# EAGLE design Adafruit AirLift FeatherWing (EAGLE 9.3.2)
COMPANY: ADAFRUIT INDUSTRIES; DRAWN: KTOWN; REV: B
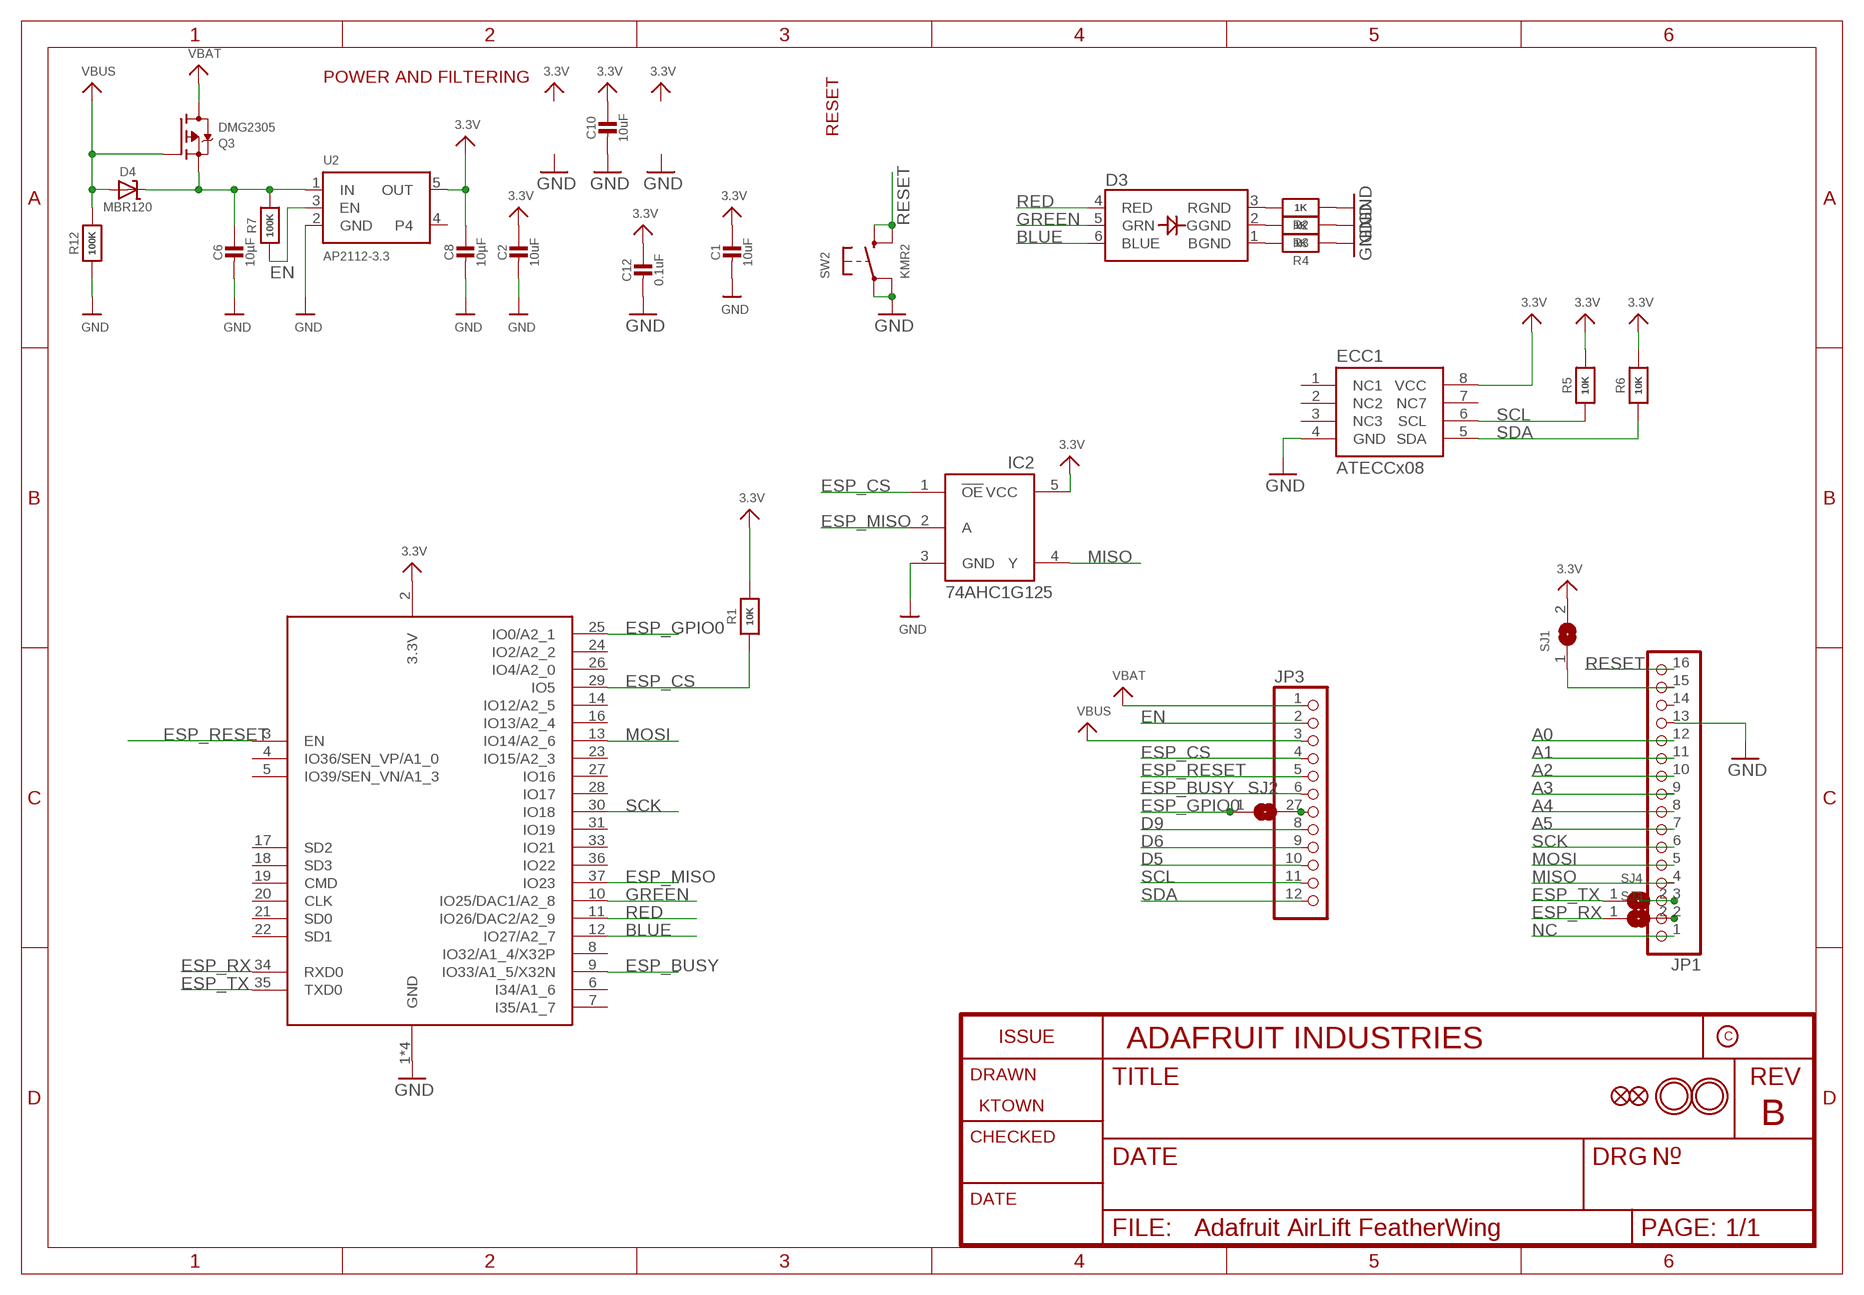
[diagram p0: schematic, sheet 1]

## Parts
C1  10uF  CAP_CERAMIC0805-NOOUTLINE  [0805-NO]
C2  10uF  CAP_CERAMIC0805-NOOUTLINE  [0805-NO]
C6  10µF  CAP_CERAMIC0805-NOOUTLINE  [0805-NO]
C8  10µF  CAP_CERAMIC0805-NOOUTLINE  [0805-NO]
C10  10uF  CAP_CERAMIC0805-NOOUTLINE  [0805-NO]
C12  0.1uF  CAP_CERAMIC0603_NO  [0603-NO]
D3  LED_RGB_PLCC6CREE-CLV6A  [RGBLED_PLCC6]
D4  MBR120  DIODE-SCHOTTKYSOD-123  [SOD-123]
ECC1  ATECCx08  ATECC108  [SOIC8]
IC2  74AHC1G125  [SOT23-5L]
JP1  HEADER-1X16_MIN  [1X16_ROUND_MIN]
JP3  HEADER-1X12_MIN  [1X12_ROUND_MIN]
Q3  DMG2305  MOSFET-P  [SOT23-R]
R1  10K  RESISTOR_0603_NOOUT  [0603-NO]
R2  1K  RESISTOR_0603_NOOUT  [0603-NO]
R3  1K  RESISTOR_0603_NOOUT  [0603-NO]
R4  1K  RESISTOR_0603_NOOUT  [0603-NO]
R5  10K  RESISTOR_0603_NOOUT  [0603-NO]
R6  10K  RESISTOR_0603_NOOUT  [0603-NO]
R7  100K  RESISTOR_0603_NOOUT  [0603-NO]
R12  100K  RESISTOR_0603_NOOUT  [0603-NO]
SJ1  SOLDERJUMPER  [SOLDERJUMPER_ARROW_NOPASTE]
SJ2  SOLDERJUMPER  [SOLDERJUMPER_ARROW_NOPASTE]
SJ3  SOLDERJUMPER  [SOLDERJUMPER_ARROW_NOPASTE]
SJ4  SOLDERJUMPER  [SOLDERJUMPER_ARROW_NOPASTE]
SW2  KMR2  SWITCH_TACT_SMT4.6X2.8  [BTN_KMR2_4.6X2.8]
U2  AP2112-3.3  VREG_SOT23-5  [SOT23-5]
U$31  MOUNTINGHOLE2.5  [MOUNTINGHOLE_2.5_PLATED]
U$32  MOUNTINGHOLE2.5  [MOUNTINGHOLE_2.5_PLATED]
U$34  FIDUCIAL_1MM  [FIDUCIAL_1MM]
U$35  FIDUCIAL_1MM  [FIDUCIAL_1MM]
X3  ESP32_WROOM32_SKINNY  [WROOM32_SKINNY]

## Nets
3.3V: C1.1 C2.1 C8.1 C10.1 C12.1 ECC1.8(VCC) IC2.5(VCC) R1.2 R5.2 R6.2 SJ1.2 U2.5(OUT) X3.2(3.3V)
A0: JP1.12
A1: JP1.11
A2: JP1.10
A3: JP1.9
A4: JP1.8
A5: JP1.7
BLUE: D3.6(BLUE) X3.12(IO27/A2_7)
D5: JP3.10
D6: JP3.9
D9: JP3.8
EN: JP3.2 R7.1 U2.3(EN)
ESP_BUSY: JP3.6 X3.9(IO33/A1_5/X32N)
ESP_CS: IC2.1(!OE) JP3.4 R1.1 X3.29(IO5)
ESP_GPIO0: SJ2.1 X3.25(IO0/A2_1)
ESP_MISO: IC2.2(A) X3.37(IO23)
ESP_RESET: JP3.5 X3.3(EN)
ESP_RX: SJ3.1 X3.34(RXD0)
ESP_TX: SJ4.1 X3.35(TXD0)
GND: C1.2 C2.2 C6.2 C8.2 C10.2 C12.2 ECC1.4(GND) IC2.3(GND) JP1.13 R2.1 R3.1 R4.1 R12.1 SW2.A'(P1) SW2.A(P) U2.2(GND) X3.1(GND) X3.15(GND) X3.38(GND) X3.P$1(GND)
GREEN: D3.5(GRN) X3.10(IO25/DAC1/A2_8)
MISO: IC2.4(Y) JP1.4
MOSI: JP1.5 X3.13(IO14/A2_6)
N$1: JP1.15 SJ1.1
N$2: D3.3(RGND) R2.2
N$3: D3.2(GGND) R3.2
N$4: D3.1(BGND) R4.2
N$5: JP3.7 SJ2.2
N$6: JP1.2 SJ3.2
N$7: C6.1 D4.C Q3.2(S) R7.2 U2.1(IN)
N$8: JP1.3 SJ4.2
NC: JP1.1
RED: D3.4(RED) X3.11(IO26/DAC2/A2_9)
RESET: JP1.16 SW2.B'(S1) SW2.B(S)
SCK: JP1.6 X3.30(IO18)
SCL: ECC1.6(SCL) JP3.11 R5.1
SDA: ECC1.5(SDA) JP3.12 R6.1
VBAT: JP3.1 Q3.3(D)
VBUS: D4.A JP3.3 Q3.1(G) R12.2
Unconnected: ECC1.1(NC1) ECC1.2(NC2) ECC1.3(NC3) ECC1.7(NC7) JP1.14 U2.4 X3.4(IO36/SEN_VP/A1_0) X3.5(IO39/SEN_VN/A1_3) X3.6(I34/A1_6) X3.7(I35/A1_7) X3.8(IO32/A1_4/X32P) X3.14(IO12/A2_5) X3.16(IO13/A2_4) X3.17(SD2) X3.18(SD3) X3.19(CMD) X3.20(CLK) X3.21(SD0) X3.22(SD1) X3.23(IO15/A2_3) X3.24(IO2/A2_2) X3.26(IO4/A2_0) X3.27(IO16) X3.28(IO17) X3.31(IO19) X3.33(IO21) X3.36(IO22)

## Notes on the sheet
- POWER AND FILTERING
- RESET

## Library data of the parts
C1 C2 C6 C10 C12 = microbuilder:CAP_CERAMIC: Ceramic Capacitors For new designs, use the packages preceded by an '_' character since they are more reliable: The following footprints should be used on most boards: _0402 - Standard footprint for regular board layouts _0603 - Standard footprint for regular board layouts _0805 - Standard footprint for regular board layouts _1206 - Standard footprint for regular board layouts For extremely tight-pitch boards where space is at a premium, the following 'micro-pitch' footprints can be used (smaller pads, no silkscreen outline, etc.): _0402MP - Micro-pitch footprint for very dense/compact boards _0603MP - Micro-pitch footprint for very dense/compact boards _0805MP - Micro-pitch footprint for very dense/compact boards _1206MP - Micro-pitch footprint for very dense/compact boards
C8 = microbuilder:CAP_CERAMIC: Ceramic Capacitors For new designs, use the packages preceded by an '_' character since they are more reliable: The following footprints should be used on most boards: _0402 - Standard footprint for regular board layouts _0603 - Standard footprint for regular board layouts _0805 - Standard footprint for regular board layouts _1206 - Standard footprint for regular board layouts For extremely tight-pitch boards where space is at a premium, the following 'micro-pitch' footprints can be used (smaller pads, no silkscreen outline, etc.): _0402MP - Micro-pitch footprint for very dense/compact boards _0603MP - Micro-pitch footprint for very dense/compact boards _0805MP - Micro-pitch footprint for very dense/compact boards _1206MP - Micro-pitch footprint for very dense/compact boards; REV: B
D3 = microbuilder:LED_RGB_PLCC6: RGB LED Cree CLV6A-FKB - Digikey: CLV6A-FKB-CK1P1G1BB7R3R3TR-ND DC Foreward Current: 20mA Foreward Voltage: R = 2.0, G = 3.2, B = 3.2 Viewing Angle: 120°
D4 = microbuilder:DIODE-SCHOTTKY
ECC1 = cryptotronix:ATECC108: ATECC108: Provides ECDSA with NIST curves P256, B283, and K283. Also, a RNG, 8.5Kb EEPROM. 2.0V - 5.5V.
IC2 = adafruit:74AHC1G125
JP1 = microbuilder:HEADER-1X16: PIN HEADER
JP3 = microbuilder:HEADER-1X12
Q3 = microbuilder:MOSFET-P: P-Channel Mosfet LEGEND VDS: Voltage Drain-Source ID: Drain Current RDS(ON): Drain-Source On-State Resistance VGS(TH): Gate-Source Threshold Voltage CISS: Drain-Source Input Capacitance SOT-23 Name VDS ID RDS(ON) VGS(TH) CISS Order Number IRLML5103 30V 760mA 600 mOhm -- 75pF @ 25V Digikey: IRLML5103PBFCT-ND IRLML6401 12V 4.3A 50 mOhm 950mV @ 250µA 830pF @ 10V Digikey: IRLML6401PBFTR-ND NTR0202PL 20V 400mA 800 mOhm 2.3V @ 250uA 70pF @ 5V Digikey: NTR0202PLT1GOSTR-ND NTR4101PT1G 20V 1.8A 85 mOhm 1.2V @ 250uA 675pF @ 10V Digikey: NTR4101PT1GOSCT-ND DMP2004K 20V 600mA 900 mOhm 1V @ 250uA 175pF @ 16V Digikey: DMP2004KDICT-ND PMV65XP 20V 3.9A 76 mOhm 950mV @ 1mA 725pF @ 20V Digikey: 568-2358-2-ND TO-252 Name VDS ID RDS(ON) VGS(TH) CISS Order Number AOD417 30V 25A 34 mOhm 3V @ 250µA 920pF @ 15V Digikey: 785-1106-2-ND PowerPak Name VDS ID RDS(ON) VGS(TH) CISS Order Number AON7401 30V 12A 14 mOhm 3V @ 250µA 2600pF @ 15V Digikey: 785-1302-1-ND
R1-R7 R12 = microbuilder:RESISTOR: Resistors For new designs, use the packages preceded by an '_' character since they are more reliable: The following footprints should be used on most boards: _0402 - Standard footprint for regular board layouts _0603 - Standard footprint for regular board layouts _0805 - Standard footprint for regular board layouts _1206 - Standard footprint for regular board layouts For extremely tight-pitch boards where space is at a premium, the following 'micro-pitch' footprints can be used (smaller pads, no silkscreen outline, etc.): _0402MP - Micro-pitch footprint for very dense/compact boards _0603MP - Micro-pitch footprint for very dense/compact boards _0805MP - Micro-pitch footprint for very dense/compact boards _1206MP - Micro-pitch footprint for very dense/compact boards
SJ1-SJ4 = microbuilder:SOLDERJUMPER: SMD Solder JUMPER Solder the two pads together to create a connection, or remove the solder to break it. REFLOW - Use this footprint for solder paste and reflow ovens. WAVE - Use this footprint for hand-soldering (larger pads). CLOSED - Has a trace between the two pads to ensure it is closed by default. The trace needs to be cut to disable the jumper, and can be closed again by creating a solder bridge between the two pads.; BOM: EXCLUDE
SW2 = microbuilder:SWITCH_TACT_SMT: SMT Tact Switches 6x6mm - Digikey: P12940SCT-ND KMR2 (4.6x2.8mm) - Digikey: 401-1426-1-ND EVQ-PQHB55 - Light Touch, 160GF (4.5x4.5mm) - Digikey: P8090SCT-ND KMT0 - KMT021 NGJ LHS (etc.) IP68/Waterproof - Digikey: CKN10289CT-ND
U2 = microbuilder:VREG_SOT23-5: SOT23-5 Fixed Voltage Regulators Part Current Out V Out V In V Dropout θJA (°C/W) TJ (°C) Digikey Part No. ADP121 150mA 3.3V 3.4-5.5V 0.09V @ 150mA -- -- ADP121-AUJZ33R7CT-ND ADP121 150mA 3.0V 3.1-5.5V 0.09V @ 150mA -- -- ADP121-AUJZ30R7CT-ND ADP122 300mA 3.3V 3.4-5.5V 0.085V @ 300mA -- -- ADP122AUJZ-3.3-R7CT-ND ADP1712 300mA 3.3V 3.5-5.5V 0.17V @ 300mA -- -- ADP1712AUJZ-3.3-R7TR-ND AP7311 (Low Cost) 150mA 3.3V 3.5-6V 0.15V @ 150mA -- -- AP7311-33WG-7DICT-ND LD39015M18R 150mA 1.8V 1.9V-5.5V 0.08V @ 100mA -- -- 497-6977-1-ND LP2985A-33DBVR 150mA 3.3V 3.3-16V 0.28V @ 150mA 206 150 296-18479-1-ND MCP1824T-3302E/OT 300mA 3.3V 3.5V-6V 0.2V @ 300mA -- -- MCP1824T-3302E/OTCT-ND MIC5205-2.5YM5 TR 150mA 2.5V 2.7-16V 0.165V @ 150mA -- -- 576-1257-2-ND MIC5205-3.0YM5 TR 150mA 3.0V 3.2V-16V 0.165V @ 150mA -- -- 576-1258-2-ND MIC5205-3.3YM5 TR 150mA 3.3V 3.5V-16V 0.165V @ 150mA -- -- 576-1259-2-ND TPS780330220 150mA 3.3V+2.2V 3.6-5.5V 250mV Max -- -- 296-23332-1-ND TDA3663/N1,135 100mA 3.3V 3.5-45V 0.18V @ 50mA -- -- 568-5343-1-ND Max operating temp can be calculated using θJA, TJ (max junction temperature), and power in watts. Set the "Maximum Ambient Temperature" until it reaches TJ ("Max Junction Temperature"), which is the absolute limit for safe use of the regulator: Heat Sink Temperature Calculator <http://www.daycounter.com/Calculators/Heat-Sink-Temperature-Calculator.phtml> For example, With 12V source into a 3.3V LP2985 and a 30mA load, we are dissipating (12V-3.3V) * 0.03A = 0.261W. With a θJA of 206 °C/W, a TJ of 150°C, and 261mW we can safely use the chip without a heat sink up to 75°C (=147.1°C Junction Temperature).
U$31 U$32 = microbuilder:MOUNTINGHOLE: Mounting Hole For #2 screws (0.086"/2.18mm width, 0.094"/2.4mm hole) use 2.5mm; BOM: EXCLUDE
U$34 U$35 = microbuilder:FIDUCIAL: Fiducial Alignment Points Various fiducial points for machine vision alignment.; BOM: EXCLUDE
X3 = microbuilder:ESP32_WROOM32

## Board
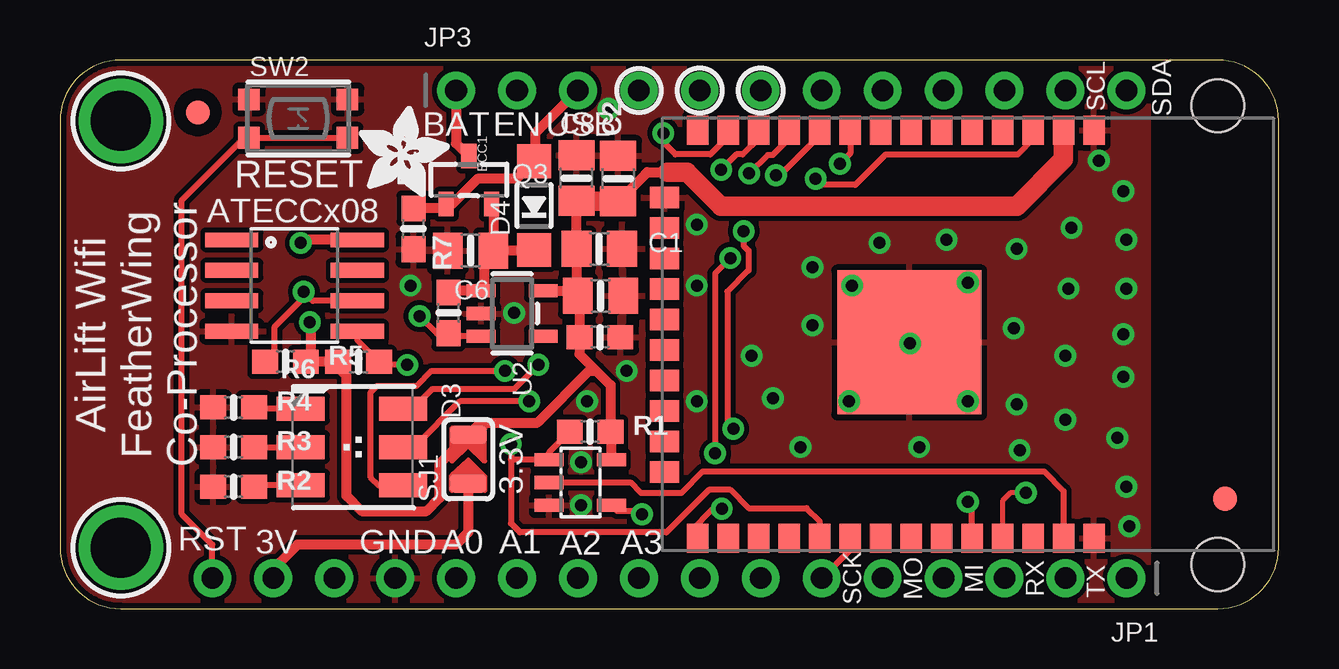
[diagram p1: board, top side]
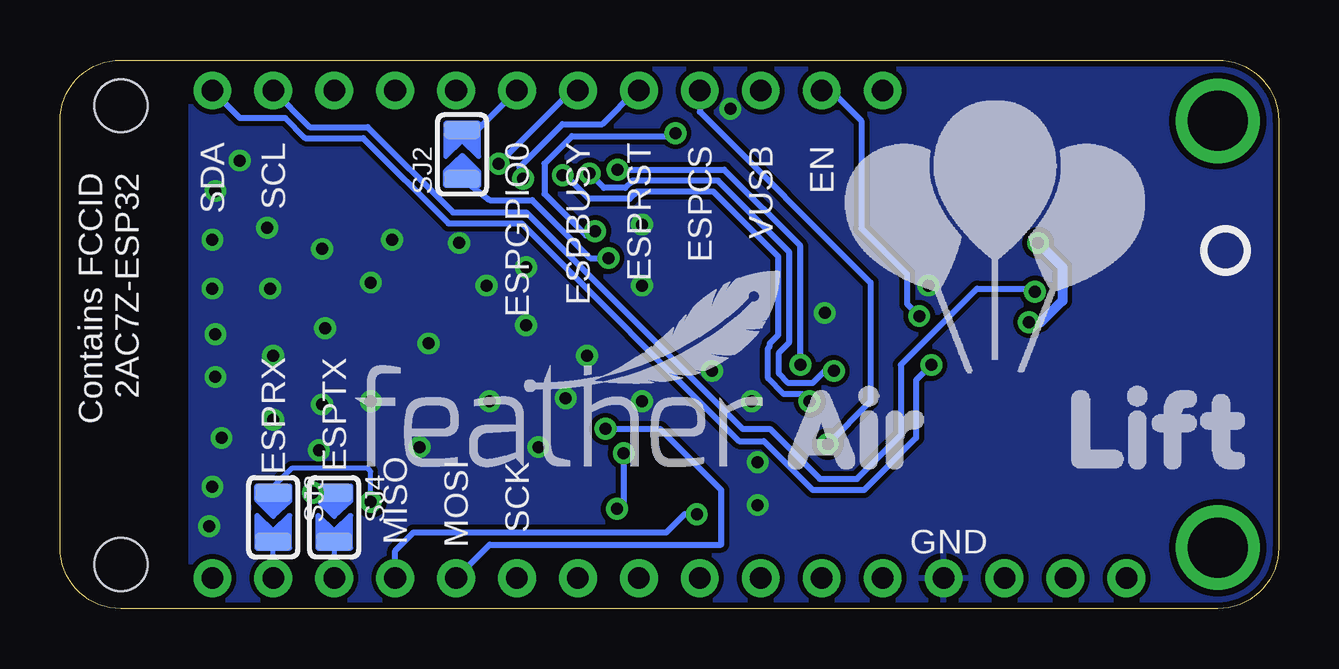
[diagram p2: board, bottom side, seen from below]

Size 50.8 x 22.86 mm. Coordinates in mm from the lower left corner, seen from the top.
Outline: 2.54,0 48.26,0 arc90 50.8,2.54 50.8,20.32 arc90 48.26,22.86 2.54,22.86 arc90 0,20.32 0,2.54 arc90 2.54,0
Copper layers (1*16): Top 0.035mm / dielectric 1.5mm / Bottom 0.035mm
Design rules "adafruit 7-7 *": minimum track width 6mil, minimum drill 15.5mil, track to track 8mil, track to pad 7mil, pad to pad 7mil, via to via 7mil, smd to smd 7mil, copper to edge 10mil, drill to drill 8mil, minimum pad ring 10mil, minimum via ring 8mil, stop-mask expansion 2mil, vias tented up to drill 20mil, thermal gap 10mil
Holes 2.2 mm at 48.26,1.84 48.26,20.95

### Footprints (pad centres in the part's own frame; a part is rotated, then mirrored left to right if it is on the bottom)
0805-NO = smd 1.24 x 1.5: 1 -0.95,0; 2 0.95,0
0603-NO = smd 1.075 x 1: 1 -0.85,0; 2 0.85,0
RGBLED_PLCC6 = smd 1 x 2: 1 -1.6,-2.158; 2 0,-2.158; 3 1.6,-2.158; 4 1.6,2.108; 5 0,2.108; 6 -1.6,2.108
SOD-123 = smd 1.4 x 1.4: A 1.85,0; C -1.85,0
SOIC8 = smd 0.61 x 2.21: 1 -1.905,-2.616; 2 -0.635,-2.616; 3 0.635,-2.616; 4 1.905,-2.616; 5 1.905,2.616; 6 0.635,2.616; 7 -0.635,2.616; 8 -1.905,2.616
SOT23-5L = smd 0.55 x 1.2: 1 -0.95,-1.3; 2 0,-1.3; 3 0.95,-1.3; 4 0.95,1.3; 5 -0.95,1.3
1X16_ROUND_MIN = drill 0.9 pad 1.575: 1 -19.05,0; 2 -16.51,0; 3 -13.97,0; 4 -11.43,0; 5 -8.89,0; 6 -6.35,0; 7 -3.81,0; 8 -1.27,0; 9 1.27,0; 10 3.81,0; 11 6.35,0; 12 8.89,0; 13 11.43,0; 14 13.97,0; 15 16.51,0; 16 19.05,0
1X12_ROUND_MIN = drill 0.9 pad 1.575: 1 -13.97,0; 2 -11.43,0; 3 -8.89,0; 4 -6.35,0; 5 -3.81,0; 6 -1.27,0; 7 1.27,0; 8 3.81,0; 9 6.35,0; 10 8.89,0; 11 11.43,0; 12 13.97,0
SOT23-R = smd 0.635 x 1.016: 1 -0.95,-1; 2 0.95,-1; 3 0,1
SOLDERJUMPER_ARROW_NOPASTE = smd 0.762 x 1.524: 1 -1.016,0; 2 1.016,0
BTN_KMR2_4.6X2.8 = smd 0.9 x 0.9: A 2.05,0.8; A' -2.05,0.8; B 2.05,-0.8; B' -2.05,-0.8
SOT23-5 = smd 0.55 x 1.2: 1 -0.95,-1.3; 2 0,-1.3; 3 0.95,-1.3; 4 0.95,1.3; 5 -0.95,1.3
MOUNTINGHOLE_2.5_PLATED = drill 2.5 pad 3.2: P$1 0,0
FIDUCIAL_1MM = smd 1 x 1: 1 0,0
WROOM32_SKINNY = smd 1.2 x 0.9: 1 -8.5,5; 2 -8.5,3.73; 3 -8.5,2.46; 4 -8.5,1.19; 5 -8.5,-0.08; 6 -8.5,-1.35; 7 -8.5,-2.62; 8 -8.5,-3.89; 9 -8.5,-5.16; 10 -8.5,-6.43; 11 -8.5,-7.7; 12 -8.5,-8.97; 13 -8.5,-10.24; 14 -8.5,-11.51; 25 8.5,-11.51; 26 8.5,-10.24; 27 8.5,-8.97; 28 8.5,-7.7; 29 8.5,-6.43; 30 8.5,-5.16; 31 8.5,-3.89; 32 8.5,-2.62; 33 8.5,-1.35; 34 8.5,-0.08; 35 8.5,1.19; 36 8.5,2.46; 37 8.5,3.73; 38 8.5,5 | smd 0.9 x 1.2: 15 -5.7,-12.9; 16 -4.43,-12.9; 17 -3.16,-12.9; 18 -1.89,-12.9; 19 -0.62,-12.9; 20 0.65,-12.9; 21 1.92,-12.9; 22 3.19,-12.9; 23 4.46,-12.9; 24 5.73,-12.9 | smd 6 x 6: P$1 0.34,-2.7

### Placement (x,y rotation side)
C1  22.48,14.99 0 top
C2  23.27,17.92 90 top
C6  17.11,14.92 180 top
C8  21.52,17.94 90 top
C10  22.53,13.03 0 top
C12  22.5,11.3 0 top
D3  12.19,6.73 270 top
D4  19.76,16.79 90 top
ECC1  9.78,13.46 270 top
IC2  21.69,5.26 270 top
JP1  25.4,1.27 180 top
JP3  30.48,21.59 0 top
Q3  17.04,17.86 0 top
R1  22.1,7.37 0 top
R2  7.24,5.08 0 top
R3  7.24,6.73 0 top
R4  7.24,8.38 0 top
R5  9.4,10.29 0 top
R6  12.45,10.29 180 top
R7  16.19,12.32 90 top
R12  14.73,15.82 90 top
SJ1  17.02,6.22 90 top
SJ2  34.04,18.92 90 bottom
SJ3  41.91,3.81 270 bottom
SJ4  39.37,3.81 270 bottom
SW2  9.93,20.42 0 top
U2  18.85,12.29 270 top
U$6  [AIRLIFT]  20.45,4.45 0 bottom
U$7  [FEATHERLOGO_MED]  38.61,5.84 0 bottom
U$13  [PCBFEAT-REV-040]  2.22,14.92 0 bottom
U$15  [ADAFRUIT_3.5MM]  12.45,17.14 0 top
U$31  2.54,20.32 270 top
U$32  2.54,2.54 270 top
U$34  5.74,20.68 270 top
U$35  48.56,4.58 270 top
X3  38.1,11.43 270 top

### Tracks (layer width: path | path; a pad name or v marks a point on that pad's centre or on a via)
3.3V  (via drill 0.5)
  Top 0.254: R6.2 R5.2
  Top 0.406: 25.32,18.19 24.48,18.19 24.4,18.1 24.4,18.09 C2.1 | 21.55,16.97 21.53,16.95 C1.1 21.53,13.08 C10.1 | U2.5 21.37,13.24 C10.1 | C10.1 21.65,12.96 C12.1 21.65,10.6 22.35,9.91 | 22.35,9.91 22.95,9.31 R1.2 22.99,7.32 IC2.5 | 22.35,9.91 22.06,9.91 19.9,7.75 17.53,7.75 SJ1.2 15.82,6.04 15.82,4.62 15.27,4.06 12.57,4.06 11.94,4.7 11.94,9.69 11.6,10.03 R6.2 10.45,10.29 10.45,11.9 v10.41,11.94 | ECC1.8 10.16,15.37 v10.03,15.24
  Top 0.813: 25.32,18.19 26.14,18.19 27.56,16.76 39.88,16.76 41.83,18.72 X3.2 | C2.1 21.55,16.97 C8.1
  Bottom 0.406: v10.03,15.24 9.02,14.22 9.02,12.83 9.91,11.94 v10.41,11.94
BLUE  (via drill 0.5)
  Top 0.254: X3.12 29.13,19.61 28.45,18.93 28.19,18.93 v27.56,18.29 | v19.94,10.16 18.92,9.14 15.52,9.14 14.71,8.33 D3.6
  Bottom 0.254: v27.56,18.29 23.12,18.29 19.94,15.11 v19.94,10.16
EN  (via drill 0.5)
  Top 0.254: U2.3 16.32,11.34 R7.1 15.71,11.47 v14.99,12.19
  Bottom 0.254: JP3.2 18.67,21.59 17.4,20.32 17.4,15.85 15.49,13.94 15.49,12.7 v14.99,12.19
ESP_BUSY  (via drill 0.5)
  Top 0.254: X3.9 32.94,18.97 v32.51,18.54
  Bottom 0.254: v32.51,18.54 29.46,21.59 JP3.6
ESP_CS  (via drill 0.5)
  Top 0.254: X3.29 31.67,3.64 31.11,4.19 28.7,4.19 27.94,4.95 27.05,4.95 25.27,3.17 19.18,3.17 18.8,3.56 18.8,6.22 | v18.8,6.86 18.8,6.22 | R1.1 20.39,6.51 IC2.1 18.81,6.21 18.8,6.22
  Bottom 0.254: JP3.4 24.13,20.7 17.02,13.59 17.02,8.64 v18.8,6.86
ESP_GPIO0  (via drill 0.5)
  Top 0.254: X3.25 26.29,3.23 27.23,4.16 v27.59,4.16 | v27.94,14.61 27.3,13.97 v27.3,6.47
  Bottom 0.254: v27.94,14.61 28.7,14.61 31.11,17.02 32.89,17.02 SJ2.1 | v27.3,6.47 27.3,4.44 v27.59,4.16
ESP_MISO
  Top 0.254: IC2.2 23.78,5.26 24.22,4.82 25.9,4.82 26.8,5.71 41.02,5.71 41.83,4.91 X3.37
ESP_RESET  (via drill 0.5)
  Top 0.254: X3.3 40.56,19.55 39.92,18.91 34.41,18.91 33.15,17.65 31.75,17.65 v31.5,17.91
  Bottom 0.254: v31.5,17.91 31.65,18.06 31.65,18.4 29.86,20.19 28.19,20.19 26.8,21.59 JP3.5
ESP_RX  (via drill 0.5)
  Top 0.254: X3.34 38.02,4.27 v37.85,4.45
  Bottom 0.203: v37.85,4.45 37.85,5.71 37.97,5.84 41.15,5.84 41.91,5.08 SJ3.1
ESP_TX  (via drill 0.5)
  Top 0.203: v40.26,4.83 39.62,4.83 39.29,4.49 X3.35
  Bottom 0.203: SJ4.1 v40.26,4.83
GND  (via drill 0.5)
  other vias: 18.92,12.32 14.61,13.46 26.54,16 23.62,9.91 26.54,13.46 22.86,20.83 21.72,4.32 21.72,6.1 37.85,13.59 44.32,17.4 43.31,18.67 44.45,15.37 44.45,13.34 44.32,11.43 44.32,9.65 44.07,7.11 44.45,5.08 44.58,3.43 41.91,7.87 41.91,10.54 42.04,13.34 42.16,15.88 39.88,14.99 36.96,15.37 34.16,15.24 31.37,14.22 31.37,11.81 28.83,10.54 29.72,8.76 39.75,11.68 39.88,8.51 40.01,6.6 35.81,6.73 30.86,6.73 35.43,11.05 33.02,13.46 32.89,8.64 37.85,8.64 26.54,8.64 21.97,8.64
  pour Top: 0,22.86 45.34,22.86 45.34,0 0,0
  pour Bottom: 0,22.86 45.34,22.86 45.34,0 0,0
GREEN  (via drill 0.5)
  Top 0.254: v29.84,18.05 30.01,18.05 31.67,19.72 X3.10 | D3.5 14.76,6.73 16.66,8.64 v19.56,8.64
  Bottom 0.254: v19.56,8.64 19.86,8.94 20.64,8.94 21.29,9.59 21.29,10.86 21.21,10.93 21.21,11.05 20.85,11.4 20.85,14.67 23.56,17.38 26.75,17.38 27.06,17.08 28.74,17.08 29.72,18.05 v29.84,18.05
MISO  (via drill 0.5)
  Top 0.254: v24.26,3.94 24.13,4.06 23.23,4.06 IC2.4
  Bottom 0.254: JP1.4 36.83,2.41 36.07,3.17 25.53,3.17 24.77,3.94 v24.26,3.94
MOSI  (via drill 0.5)
  Top 0.254: v25.15,19.81 25.15,19.43 25.65,18.92 27.11,18.92 27.86,19.68 X3.13 | v28.5,15.73 28.5,15.12 28.7,14.92 28.7,14.09 27.81,13.21 27.81,7.74 v28.06,7.49
  Bottom 0.254: JP1.5 32.89,2.67 23.24,2.67 23.24,4.95 25.78,7.49 v28.06,7.49 | v25.15,19.81 25.4,19.81 25.53,19.68 29.46,19.68 30.6,18.55 30.6,17.28 28.88,15.56 28.71,15.73 v28.5,15.73
N$1
  Top 0.406: SJ1.1 17.02,3.17 16.51,2.67 9.91,2.67 8.89,1.65 JP1.15
N$2
  Top 0.254: D3.3 8.14,5.13 R2.2
N$3
  Top 0.254: R3.2 D3.2
N$4
  Top 0.254: D3.1 8.14,8.33 R4.2
N$5
  Bottom 0.254: JP3.7 33.66,19.68 SJ2.2
N$6
  Bottom 0.203: JP1.2 SJ3.2
N$7
  Top 0.406: D4.C 19.74,14.92 C6.1 | Q3.2 18.07,16.79 C6.1 | R7.2 16.27,13.24 U2.1 17.68,13.24 17.68,14.54 C6.1
N$8
  Bottom 0.203: SJ4.2 JP1.3
RED  (via drill 0.5)
  Top 0.254: v28.73,18.14 29.49,18.9 29.71,18.9 30.4,19.59 X3.11 | D3.4 13.28,5.13 12.95,5.46 12.95,9.02 13.21,9.27 14.86,9.27 15.49,9.91 v18.54,9.91
  Bottom 0.254: v18.54,9.91 18.92,9.91 19.43,9.4 20.45,9.4 20.83,9.78 20.83,10.67 20.4,11.1 20.4,14.86 23.37,17.84 26.94,17.84 27.25,17.53 28.13,17.53 v28.73,18.14
RESET
  Top 0.254: SW2.B SW2.B' 7.68,19.62 5.08,17.02 5.08,3.94 6.35,2.67 JP1.16
SCK
  Top 0.254: X3.30 32.94,2.46 JP1.6
SCL  (via drill 0.5)
  Top 0.254: ECC1.6 10.54,12.83 v10.16,13.21 10.16,12.95 8.93,11.72 8.93,10.67 R5.1
  Bottom 0.254: JP3.11 40.39,20.07 37.97,20.07 34.42,16.51 31.37,16.51 22.35,7.49 21.21,7.49 19.13,5.41 17.58,5.41 15.75,7.24 15.75,10.16 12.57,13.34 10.29,13.34 v10.16,13.21
SDA  (via drill 0.5)
  Top 0.254: v14.48,10.16 13.43,10.16 R6.1 12.39,11.19 ECC1.5
  Bottom 0.254: JP3.12 43.31,20.45 41.41,20.45 40.58,19.61 38.16,19.61 34.61,16.05 31.56,16.05 22.49,6.99 21.46,6.99 19.43,4.95 17.27,4.95 15.11,7.11 15.11,9.52 v14.48,10.16
VBAT
  Top 0.406: JP3.1 16.51,19.39 Q3.3
VBUS
  Top 0.254: D4.A
  Top 0.406: JP3.3 19.81,19.81 19.81,18.69 D4.A 19.03,17.91 17.4,17.91 16.35,16.86 Q3.1 15.91,16.67 R12.2

### Text on the board
tPlace: SCL | SDA | BAT | EN | USB | RESET | ATECCx08 | AirLift Wifi / FeatherWing / Co-Processor | 3.3V | RST | 3V | GND | A0 | A1 | A2 | A3 | SCK | MO | MI | RX | TX
bPlace: EN | VUSB | ESPCS | ESPRST | ESPBUSY | ESPGPIO0 | SCL | SDA | Contains FCCID / 2AC7Z-ESP32 | ESPTX | ESPRX | GND | SCK | MOSI | MISO